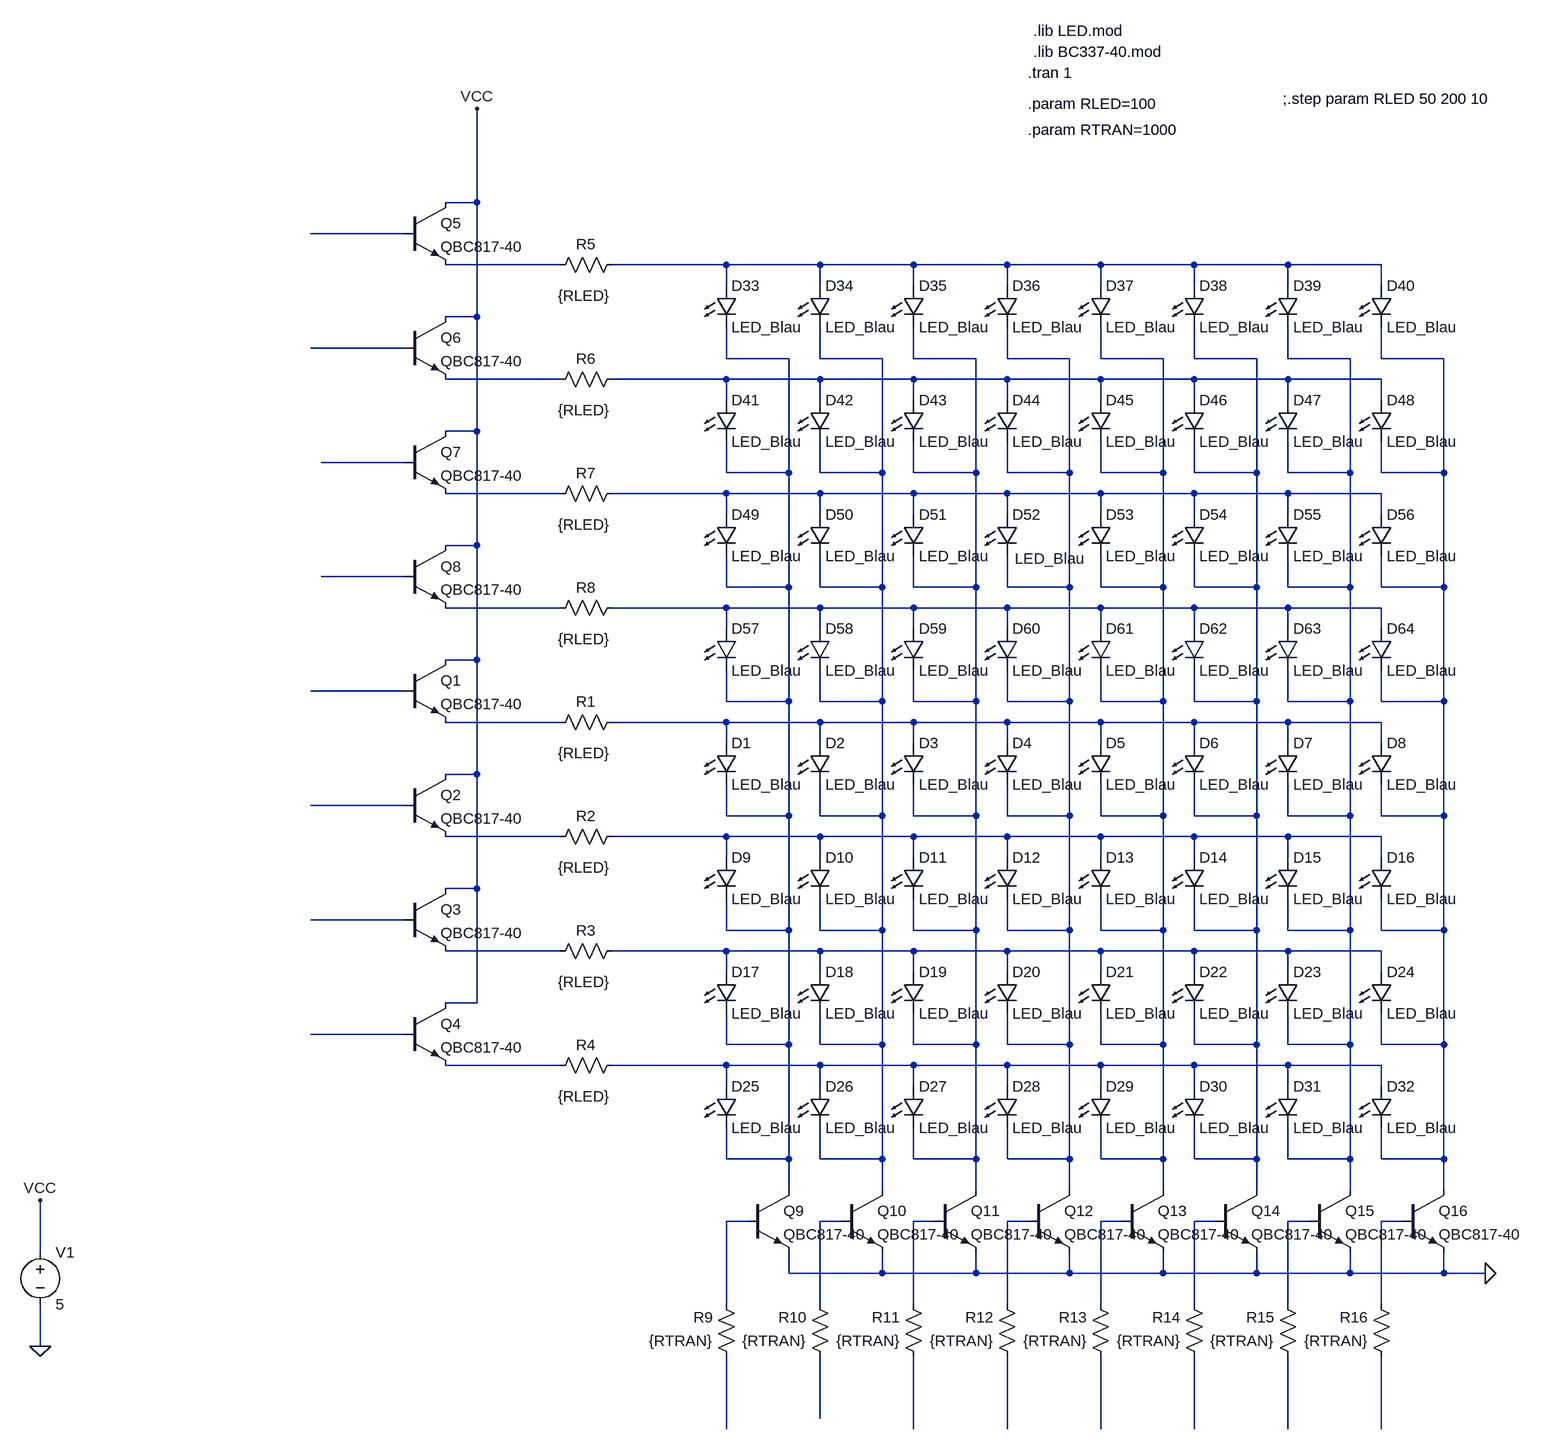
[diagram p0: schematic Schaltplan.asc]
Schaltplan.asc, the LTspice schematic file:
Version 4
SHEET 1 1296 808
WIRE -400 -1136 -400 -1280
WIRE -400 -1136 -448 -1136
WIRE -512 -1088 -656 -1088
WIRE -272 -1040 -448 -1040
WIRE -16 -1040 -192 -1040
WIRE 128 -1040 -16 -1040
WIRE 272 -1040 128 -1040
WIRE 416 -1040 272 -1040
WIRE 560 -1040 416 -1040
WIRE 704 -1040 560 -1040
WIRE 848 -1040 704 -1040
WIRE 992 -1040 848 -1040
WIRE -16 -1008 -16 -1040
WIRE 128 -1008 128 -1040
WIRE 272 -1008 272 -1040
WIRE 416 -1008 416 -1040
WIRE 560 -1008 560 -1040
WIRE 704 -1008 704 -1040
WIRE 848 -1008 848 -1040
WIRE 992 -1008 992 -1040
WIRE -400 -960 -400 -1136
WIRE -400 -960 -448 -960
WIRE -512 -912 -656 -912
WIRE -16 -896 -16 -944
WIRE 80 -896 -16 -896
WIRE 128 -896 128 -944
WIRE 224 -896 128 -896
WIRE 272 -896 272 -944
WIRE 368 -896 272 -896
WIRE 416 -896 416 -944
WIRE 512 -896 416 -896
WIRE 560 -896 560 -944
WIRE 656 -896 560 -896
WIRE 704 -896 704 -944
WIRE 800 -896 704 -896
WIRE 848 -896 848 -944
WIRE 944 -896 848 -896
WIRE 992 -896 992 -944
WIRE 1088 -896 992 -896
WIRE -272 -864 -448 -864
WIRE -16 -864 -192 -864
WIRE 128 -864 -16 -864
WIRE 272 -864 128 -864
WIRE 416 -864 272 -864
WIRE 560 -864 416 -864
WIRE 704 -864 560 -864
WIRE 848 -864 704 -864
WIRE 992 -864 848 -864
WIRE -16 -832 -16 -864
WIRE 128 -832 128 -864
WIRE 272 -832 272 -864
WIRE 416 -832 416 -864
WIRE 560 -832 560 -864
WIRE 704 -832 704 -864
WIRE 848 -832 848 -864
WIRE 992 -832 992 -864
WIRE -400 -784 -400 -960
WIRE -400 -784 -448 -784
WIRE -512 -736 -640 -736
WIRE -16 -720 -16 -768
WIRE 80 -720 80 -896
WIRE 80 -720 -16 -720
WIRE 128 -720 128 -768
WIRE 224 -720 224 -896
WIRE 224 -720 128 -720
WIRE 272 -720 272 -768
WIRE 368 -720 368 -896
WIRE 368 -720 272 -720
WIRE 416 -720 416 -768
WIRE 512 -720 512 -896
WIRE 512 -720 416 -720
WIRE 560 -720 560 -768
WIRE 656 -720 656 -896
WIRE 656 -720 560 -720
WIRE 704 -720 704 -768
WIRE 800 -720 800 -896
WIRE 800 -720 704 -720
WIRE 848 -720 848 -768
WIRE 944 -720 944 -896
WIRE 944 -720 848 -720
WIRE 992 -720 992 -768
WIRE 1088 -720 1088 -896
WIRE 1088 -720 992 -720
WIRE -272 -688 -448 -688
WIRE -16 -688 -192 -688
WIRE 128 -688 -16 -688
WIRE 272 -688 128 -688
WIRE 416 -688 272 -688
WIRE 560 -688 416 -688
WIRE 704 -688 560 -688
WIRE 848 -688 704 -688
WIRE 992 -688 848 -688
WIRE -16 -656 -16 -688
WIRE 128 -656 128 -688
WIRE 272 -656 272 -688
WIRE 416 -656 416 -688
WIRE 560 -656 560 -688
WIRE 704 -656 704 -688
WIRE 848 -656 848 -688
WIRE 992 -656 992 -688
WIRE -400 -608 -400 -784
WIRE -400 -608 -448 -608
WIRE -512 -560 -640 -560
WIRE -16 -544 -16 -592
WIRE 80 -544 80 -720
WIRE 80 -544 -16 -544
WIRE 128 -544 128 -592
WIRE 224 -544 224 -720
WIRE 224 -544 128 -544
WIRE 272 -544 272 -592
WIRE 368 -544 368 -720
WIRE 368 -544 272 -544
WIRE 416 -544 416 -592
WIRE 512 -544 512 -720
WIRE 512 -544 416 -544
WIRE 560 -544 560 -592
WIRE 656 -544 656 -720
WIRE 656 -544 560 -544
WIRE 704 -544 704 -592
WIRE 800 -544 800 -720
WIRE 800 -544 704 -544
WIRE 848 -544 848 -592
WIRE 944 -544 944 -720
WIRE 944 -544 848 -544
WIRE 992 -544 992 -592
WIRE 1088 -544 1088 -720
WIRE 1088 -544 992 -544
WIRE -272 -512 -448 -512
WIRE -16 -512 -192 -512
WIRE 128 -512 -16 -512
WIRE 272 -512 128 -512
WIRE 416 -512 272 -512
WIRE 560 -512 416 -512
WIRE 704 -512 560 -512
WIRE 848 -512 704 -512
WIRE 992 -512 848 -512
WIRE -16 -480 -16 -512
WIRE 128 -480 128 -512
WIRE 272 -480 272 -512
WIRE 416 -480 416 -512
WIRE 560 -480 560 -512
WIRE 704 -480 704 -512
WIRE 848 -480 848 -512
WIRE 992 -480 992 -512
WIRE -400 -432 -400 -608
WIRE -400 -432 -448 -432
WIRE -512 -384 -656 -384
WIRE -16 -368 -16 -416
WIRE 80 -368 80 -544
WIRE 80 -368 -16 -368
WIRE 128 -368 128 -416
WIRE 224 -368 224 -544
WIRE 224 -368 128 -368
WIRE 272 -368 272 -416
WIRE 368 -368 368 -544
WIRE 368 -368 272 -368
WIRE 416 -368 416 -416
WIRE 512 -368 512 -544
WIRE 512 -368 416 -368
WIRE 560 -368 560 -416
WIRE 656 -368 656 -544
WIRE 656 -368 560 -368
WIRE 704 -368 704 -416
WIRE 800 -368 800 -544
WIRE 800 -368 704 -368
WIRE 848 -368 848 -416
WIRE 944 -368 944 -544
WIRE 944 -368 848 -368
WIRE 992 -368 992 -416
WIRE 1088 -368 1088 -544
WIRE 1088 -368 992 -368
WIRE -272 -336 -448 -336
WIRE -16 -336 -192 -336
WIRE 128 -336 -16 -336
WIRE 272 -336 128 -336
WIRE 416 -336 272 -336
WIRE 560 -336 416 -336
WIRE 704 -336 560 -336
WIRE 848 -336 704 -336
WIRE 992 -336 848 -336
WIRE -16 -304 -16 -336
WIRE 128 -304 128 -336
WIRE 272 -304 272 -336
WIRE 416 -304 416 -336
WIRE 560 -304 560 -336
WIRE 704 -304 704 -336
WIRE 848 -304 848 -336
WIRE 992 -304 992 -336
WIRE -400 -256 -400 -432
WIRE -400 -256 -448 -256
WIRE -512 -208 -656 -208
WIRE -16 -192 -16 -240
WIRE 80 -192 80 -368
WIRE 80 -192 -16 -192
WIRE 128 -192 128 -240
WIRE 224 -192 224 -368
WIRE 224 -192 128 -192
WIRE 272 -192 272 -240
WIRE 368 -192 368 -368
WIRE 368 -192 272 -192
WIRE 416 -192 416 -240
WIRE 512 -192 512 -368
WIRE 512 -192 416 -192
WIRE 560 -192 560 -240
WIRE 656 -192 656 -368
WIRE 656 -192 560 -192
WIRE 704 -192 704 -240
WIRE 800 -192 800 -368
WIRE 800 -192 704 -192
WIRE 848 -192 848 -240
WIRE 944 -192 944 -368
WIRE 944 -192 848 -192
WIRE 992 -192 992 -240
WIRE 1088 -192 1088 -368
WIRE 1088 -192 992 -192
WIRE -272 -160 -448 -160
WIRE -16 -160 -192 -160
WIRE 128 -160 -16 -160
WIRE 272 -160 128 -160
WIRE 416 -160 272 -160
WIRE 560 -160 416 -160
WIRE 704 -160 560 -160
WIRE 848 -160 704 -160
WIRE 992 -160 848 -160
WIRE -16 -128 -16 -160
WIRE 128 -128 128 -160
WIRE 272 -128 272 -160
WIRE 416 -128 416 -160
WIRE 560 -128 560 -160
WIRE 704 -128 704 -160
WIRE 848 -128 848 -160
WIRE 992 -128 992 -160
WIRE -400 -80 -400 -256
WIRE -400 -80 -448 -80
WIRE -512 -32 -656 -32
WIRE -16 -16 -16 -64
WIRE 80 -16 80 -192
WIRE 80 -16 -16 -16
WIRE 128 -16 128 -64
WIRE 224 -16 224 -192
WIRE 224 -16 128 -16
WIRE 272 -16 272 -64
WIRE 368 -16 368 -192
WIRE 368 -16 272 -16
WIRE 416 -16 416 -64
WIRE 512 -16 512 -192
WIRE 512 -16 416 -16
WIRE 560 -16 560 -64
WIRE 656 -16 656 -192
WIRE 656 -16 560 -16
WIRE 704 -16 704 -64
WIRE 800 -16 800 -192
WIRE 800 -16 704 -16
WIRE 848 -16 848 -64
WIRE 944 -16 944 -192
WIRE 944 -16 848 -16
WIRE 992 -16 992 -64
WIRE 1088 -16 1088 -192
WIRE 1088 -16 992 -16
WIRE -272 16 -448 16
WIRE -16 16 -192 16
WIRE 128 16 -16 16
WIRE 272 16 128 16
WIRE 416 16 272 16
WIRE 560 16 416 16
WIRE 704 16 560 16
WIRE 848 16 704 16
WIRE 992 16 848 16
WIRE -16 48 -16 16
WIRE 128 48 128 16
WIRE 272 48 272 16
WIRE 416 48 416 16
WIRE 560 48 560 16
WIRE 704 48 704 16
WIRE 848 48 848 16
WIRE 992 48 992 16
WIRE -400 96 -400 -80
WIRE -400 96 -448 96
WIRE -512 144 -656 144
WIRE -16 160 -16 112
WIRE 80 160 80 -16
WIRE 80 160 -16 160
WIRE 128 160 128 112
WIRE 224 160 224 -16
WIRE 224 160 128 160
WIRE 272 160 272 112
WIRE 368 160 368 -16
WIRE 368 160 272 160
WIRE 416 160 416 112
WIRE 512 160 512 -16
WIRE 512 160 416 160
WIRE 560 160 560 112
WIRE 656 160 656 -16
WIRE 656 160 560 160
WIRE 704 160 704 112
WIRE 800 160 800 -16
WIRE 800 160 704 160
WIRE 848 160 848 112
WIRE 944 160 944 -16
WIRE 944 160 848 160
WIRE 992 160 992 112
WIRE 1088 160 1088 -16
WIRE 1088 160 992 160
WIRE -272 192 -448 192
WIRE -16 192 -192 192
WIRE 128 192 -16 192
WIRE 272 192 128 192
WIRE 416 192 272 192
WIRE 560 192 416 192
WIRE 704 192 560 192
WIRE 848 192 704 192
WIRE 992 192 848 192
WIRE -16 224 -16 192
WIRE 128 224 128 192
WIRE 272 224 272 192
WIRE 416 224 416 192
WIRE 560 224 560 192
WIRE 704 224 704 192
WIRE 848 224 848 192
WIRE 992 224 992 192
WIRE -16 336 -16 288
WIRE 80 336 80 160
WIRE 80 336 -16 336
WIRE 128 336 128 288
WIRE 224 336 224 160
WIRE 224 336 128 336
WIRE 272 336 272 288
WIRE 368 336 368 160
WIRE 368 336 272 336
WIRE 416 336 416 288
WIRE 512 336 512 160
WIRE 512 336 416 336
WIRE 560 336 560 288
WIRE 656 336 656 160
WIRE 656 336 560 336
WIRE 704 336 704 288
WIRE 800 336 800 160
WIRE 800 336 704 336
WIRE 848 336 848 288
WIRE 944 336 944 160
WIRE 944 336 848 336
WIRE 992 336 992 288
WIRE 1088 336 1088 160
WIRE 1088 336 992 336
WIRE 80 384 80 336
WIRE 224 384 224 336
WIRE 368 384 368 336
WIRE 512 384 512 336
WIRE 656 384 656 336
WIRE 800 384 800 336
WIRE 944 384 944 336
WIRE 1088 384 1088 336
WIRE 16 432 -16 432
WIRE 160 432 128 432
WIRE 304 432 272 432
WIRE 448 432 416 432
WIRE 592 432 560 432
WIRE 736 432 704 432
WIRE 880 432 848 432
WIRE 1024 432 992 432
WIRE -1072 480 -1072 400
WIRE 80 512 80 480
WIRE 224 512 224 480
WIRE 224 512 80 512
WIRE 368 512 368 480
WIRE 368 512 224 512
WIRE 512 512 512 480
WIRE 512 512 368 512
WIRE 656 512 656 480
WIRE 656 512 512 512
WIRE 800 512 800 480
WIRE 800 512 656 512
WIRE 944 512 944 480
WIRE 944 512 800 512
WIRE 1088 512 1088 480
WIRE 1088 512 944 512
WIRE 1152 512 1088 512
WIRE -16 560 -16 432
WIRE 128 560 128 432
WIRE 272 560 272 432
WIRE 416 560 416 432
WIRE 560 560 560 432
WIRE 704 560 704 432
WIRE 848 560 848 432
WIRE 992 560 992 432
WIRE -1072 624 -1072 560
WIRE 128 736 128 640
WIRE -16 752 -16 640
WIRE 272 752 272 640
WIRE 416 752 416 640
WIRE 560 752 560 640
WIRE 704 752 704 640
WIRE 848 752 848 640
WIRE 992 752 992 640
FLAG 1152 512 0
FLAG -400 -1280 VCC
FLAG -1072 624 0
FLAG -1072 400 VCC
SYMBOL LED -32 -304 R0
SYMATTR InstName D1
SYMATTR Value LED_Blau
SYMBOL res -176 -352 R90
WINDOW 0 0 56 VBottom 2
WINDOW 3 48 59 VTop 2
SYMATTR InstName R1
SYMATTR Value {RLED}
SYMBOL npn -512 -432 R0
SYMATTR InstName Q1
SYMATTR Value QBC817-40
SYMBOL LED 112 -304 R0
SYMATTR InstName D2
SYMATTR Value LED_Blau
SYMBOL LED 256 -304 R0
SYMATTR InstName D3
SYMATTR Value LED_Blau
SYMBOL LED 400 -304 R0
SYMATTR InstName D4
SYMATTR Value LED_Blau
SYMBOL LED 544 -304 R0
SYMATTR InstName D5
SYMATTR Value LED_Blau
SYMBOL LED 688 -304 R0
SYMATTR InstName D6
SYMATTR Value LED_Blau
SYMBOL LED 832 -304 R0
SYMATTR InstName D7
SYMATTR Value LED_Blau
SYMBOL LED 976 -304 R0
SYMATTR InstName D8
SYMATTR Value LED_Blau
SYMBOL LED -32 -128 R0
SYMATTR InstName D9
SYMATTR Value LED_Blau
SYMBOL res -176 -176 R90
WINDOW 0 0 56 VBottom 2
WINDOW 3 48 59 VTop 2
SYMATTR InstName R2
SYMATTR Value {RLED}
SYMBOL npn -512 -256 R0
SYMATTR InstName Q2
SYMATTR Value QBC817-40
SYMBOL LED 112 -128 R0
SYMATTR InstName D10
SYMATTR Value LED_Blau
SYMBOL LED 256 -128 R0
SYMATTR InstName D11
SYMATTR Value LED_Blau
SYMBOL LED 400 -128 R0
SYMATTR InstName D12
SYMATTR Value LED_Blau
SYMBOL LED 544 -128 R0
SYMATTR InstName D13
SYMATTR Value LED_Blau
SYMBOL LED 688 -128 R0
SYMATTR InstName D14
SYMATTR Value LED_Blau
SYMBOL LED 832 -128 R0
SYMATTR InstName D15
SYMATTR Value LED_Blau
SYMBOL LED 976 -128 R0
SYMATTR InstName D16
SYMATTR Value LED_Blau
SYMBOL LED -32 48 R0
SYMATTR InstName D17
SYMATTR Value LED_Blau
SYMBOL res -176 0 R90
WINDOW 0 0 56 VBottom 2
WINDOW 3 48 59 VTop 2
SYMATTR InstName R3
SYMATTR Value {RLED}
SYMBOL npn -512 -80 R0
SYMATTR InstName Q3
SYMATTR Value QBC817-40
SYMBOL LED 112 48 R0
SYMATTR InstName D18
SYMATTR Value LED_Blau
SYMBOL LED 256 48 R0
SYMATTR InstName D19
SYMATTR Value LED_Blau
SYMBOL LED 400 48 R0
SYMATTR InstName D20
SYMATTR Value LED_Blau
SYMBOL LED 544 48 R0
SYMATTR InstName D21
SYMATTR Value LED_Blau
SYMBOL LED 688 48 R0
SYMATTR InstName D22
SYMATTR Value LED_Blau
SYMBOL LED 832 48 R0
SYMATTR InstName D23
SYMATTR Value LED_Blau
SYMBOL LED 976 48 R0
SYMATTR InstName D24
SYMATTR Value LED_Blau
SYMBOL LED -32 224 R0
SYMATTR InstName D25
SYMATTR Value LED_Blau
SYMBOL res -176 176 R90
WINDOW 0 0 56 VBottom 2
WINDOW 3 48 59 VTop 2
SYMATTR InstName R4
SYMATTR Value {RLED}
SYMBOL npn -512 96 R0
SYMATTR InstName Q4
SYMATTR Value QBC817-40
SYMBOL LED 112 224 R0
SYMATTR InstName D26
SYMATTR Value LED_Blau
SYMBOL LED 256 224 R0
SYMATTR InstName D27
SYMATTR Value LED_Blau
SYMBOL LED 400 224 R0
SYMATTR InstName D28
SYMATTR Value LED_Blau
SYMBOL LED 544 224 R0
SYMATTR InstName D29
SYMATTR Value LED_Blau
SYMBOL LED 688 224 R0
SYMATTR InstName D30
SYMATTR Value LED_Blau
SYMBOL LED 832 224 R0
SYMATTR InstName D31
SYMATTR Value LED_Blau
SYMBOL LED 976 224 R0
SYMATTR InstName D32
SYMATTR Value LED_Blau
SYMBOL LED -32 -1008 R0
SYMATTR InstName D33
SYMATTR Value LED_Blau
SYMBOL res -176 -1056 R90
WINDOW 0 0 56 VBottom 2
WINDOW 3 48 59 VTop 2
SYMATTR InstName R5
SYMATTR Value {RLED}
SYMBOL npn -512 -1136 R0
SYMATTR InstName Q5
SYMATTR Value QBC817-40
SYMBOL LED 112 -1008 R0
SYMATTR InstName D34
SYMATTR Value LED_Blau
SYMBOL LED 256 -1008 R0
SYMATTR InstName D35
SYMATTR Value LED_Blau
SYMBOL LED 400 -1008 R0
SYMATTR InstName D36
SYMATTR Value LED_Blau
SYMBOL LED 544 -1008 R0
SYMATTR InstName D37
SYMATTR Value LED_Blau
SYMBOL LED 688 -1008 R0
SYMATTR InstName D38
SYMATTR Value LED_Blau
SYMBOL LED 832 -1008 R0
SYMATTR InstName D39
SYMATTR Value LED_Blau
SYMBOL LED 976 -1008 R0
SYMATTR InstName D40
SYMATTR Value LED_Blau
SYMBOL LED -32 -832 R0
SYMATTR InstName D41
SYMATTR Value LED_Blau
SYMBOL res -176 -880 R90
WINDOW 0 0 56 VBottom 2
WINDOW 3 48 59 VTop 2
SYMATTR InstName R6
SYMATTR Value {RLED}
SYMBOL npn -512 -960 R0
SYMATTR InstName Q6
SYMATTR Value QBC817-40
SYMBOL LED 112 -832 R0
SYMATTR InstName D42
SYMATTR Value LED_Blau
SYMBOL LED 256 -832 R0
SYMATTR InstName D43
SYMATTR Value LED_Blau
SYMBOL LED 400 -832 R0
SYMATTR InstName D44
SYMATTR Value LED_Blau
SYMBOL LED 544 -832 R0
SYMATTR InstName D45
SYMATTR Value LED_Blau
SYMBOL LED 688 -832 R0
SYMATTR InstName D46
SYMATTR Value LED_Blau
SYMBOL LED 832 -832 R0
SYMATTR InstName D47
SYMATTR Value LED_Blau
SYMBOL LED 976 -832 R0
SYMATTR InstName D48
SYMATTR Value LED_Blau
SYMBOL LED -32 -656 R0
SYMATTR InstName D49
SYMATTR Value LED_Blau
SYMBOL res -176 -704 R90
WINDOW 0 0 56 VBottom 2
WINDOW 3 48 59 VTop 2
SYMATTR InstName R7
SYMATTR Value {RLED}
SYMBOL npn -512 -784 R0
SYMATTR InstName Q7
SYMATTR Value QBC817-40
SYMBOL LED 112 -656 R0
SYMATTR InstName D50
SYMATTR Value LED_Blau
SYMBOL LED 256 -656 R0
SYMATTR InstName D51
SYMATTR Value LED_Blau
SYMBOL LED 400 -656 R0
WINDOW 3 28 68 Left 2
SYMATTR Value LED_Blau
SYMATTR InstName D52
SYMBOL LED 544 -656 R0
SYMATTR InstName D53
SYMATTR Value LED_Blau
SYMBOL LED 688 -656 R0
SYMATTR InstName D54
SYMATTR Value LED_Blau
SYMBOL LED 832 -656 R0
SYMATTR InstName D55
SYMATTR Value LED_Blau
SYMBOL LED 976 -656 R0
SYMATTR InstName D56
SYMATTR Value LED_Blau
SYMBOL LED -32 -480 R0
SYMATTR InstName D57
SYMATTR Value LED_Blau
SYMBOL res -176 -528 R90
WINDOW 0 0 56 VBottom 2
WINDOW 3 48 59 VTop 2
SYMATTR InstName R8
SYMATTR Value {RLED}
SYMBOL npn -512 -608 R0
SYMATTR InstName Q8
SYMATTR Value QBC817-40
SYMBOL LED 112 -480 R0
SYMATTR InstName D58
SYMATTR Value LED_Blau
SYMBOL LED 256 -480 R0
SYMATTR InstName D59
SYMATTR Value LED_Blau
SYMBOL LED 400 -480 R0
SYMATTR InstName D60
SYMATTR Value LED_Blau
SYMBOL LED 544 -480 R0
SYMATTR InstName D61
SYMATTR Value LED_Blau
SYMBOL LED 688 -480 R0
SYMATTR InstName D62
SYMATTR Value LED_Blau
SYMBOL LED 832 -480 R0
SYMATTR InstName D63
SYMATTR Value LED_Blau
SYMBOL LED 976 -480 R0
SYMATTR InstName D64
SYMATTR Value LED_Blau
SYMBOL npn 16 384 R0
SYMATTR InstName Q9
SYMATTR Value QBC817-40
SYMBOL npn 160 384 R0
SYMATTR InstName Q10
SYMATTR Value QBC817-40
SYMBOL npn 304 384 R0
SYMATTR InstName Q11
SYMATTR Value QBC817-40
SYMBOL npn 448 384 R0
SYMATTR InstName Q12
SYMATTR Value QBC817-40
SYMBOL npn 592 384 R0
SYMATTR InstName Q13
SYMATTR Value QBC817-40
SYMBOL npn 736 384 R0
SYMATTR InstName Q14
SYMATTR Value QBC817-40
SYMBOL npn 880 384 R0
SYMATTR InstName Q15
SYMATTR Value QBC817-40
SYMBOL npn 1024 384 R0
SYMATTR InstName Q16
SYMATTR Value QBC817-40
SYMBOL res 0 656 R180
WINDOW 0 36 76 Left 2
WINDOW 3 36 40 Left 2
SYMATTR InstName R9
SYMATTR Value {RTRAN}
SYMBOL res 144 656 R180
WINDOW 0 36 76 Left 2
WINDOW 3 36 40 Left 2
SYMATTR InstName R10
SYMATTR Value {RTRAN}
SYMBOL res 288 656 R180
WINDOW 0 36 76 Left 2
WINDOW 3 36 40 Left 2
SYMATTR InstName R11
SYMATTR Value {RTRAN}
SYMBOL res 432 656 R180
WINDOW 0 36 76 Left 2
WINDOW 3 36 40 Left 2
SYMATTR InstName R12
SYMATTR Value {RTRAN}
SYMBOL res 576 656 R180
WINDOW 0 36 76 Left 2
WINDOW 3 36 40 Left 2
SYMATTR InstName R13
SYMATTR Value {RTRAN}
SYMBOL res 720 656 R180
WINDOW 0 36 76 Left 2
WINDOW 3 36 40 Left 2
SYMATTR InstName R14
SYMATTR Value {RTRAN}
SYMBOL res 864 656 R180
WINDOW 0 36 76 Left 2
WINDOW 3 36 40 Left 2
SYMATTR InstName R15
SYMATTR Value {RTRAN}
SYMBOL res 1008 656 R180
WINDOW 0 36 76 Left 2
WINDOW 3 36 40 Left 2
SYMATTR InstName R16
SYMATTR Value {RTRAN}
SYMBOL voltage -1072 464 R0
WINDOW 123 0 0 Left 2
WINDOW 39 0 0 Left 2
SYMATTR InstName V1
SYMATTR Value 5
TEXT 456 -1368 Left 2 !.lib BC337-40.mod
TEXT 456 -1400 Left 2 !.lib LED.mod
TEXT 448 -1336 Left 2 !.tran 1
TEXT 448 -1288 Left 2 !.param RLED=100
TEXT 448 -1248 Left 2 !.param RTRAN=1000
TEXT 840 -1296 Left 2 !;.step param RLED 50 200 10

The netlist it stands for:
* Schaltplan.asc
D1 N023 N005 LED_Blau
R1 N023 N022 {RLED}
Q1 VCC N021 N022 0 QBC817-40
D2 N023 N006 LED_Blau
D3 N023 N007 LED_Blau
D4 N023 N008 LED_Blau
D5 N023 N009 LED_Blau
D6 N023 N010 LED_Blau
D7 N023 N011 LED_Blau
D8 N023 N012 LED_Blau
D9 N026 N005 LED_Blau
R2 N026 N025 {RLED}
Q2 VCC N024 N025 0 QBC817-40
D10 N026 N006 LED_Blau
D11 N026 N007 LED_Blau
D12 N026 N008 LED_Blau
D13 N026 N009 LED_Blau
D14 N026 N010 LED_Blau
D15 N026 N011 LED_Blau
D16 N026 N012 LED_Blau
D17 N029 N005 LED_Blau
R3 N029 N028 {RLED}
Q3 VCC N027 N028 0 QBC817-40
D18 N029 N006 LED_Blau
D19 N029 N007 LED_Blau
D20 N029 N008 LED_Blau
D21 N029 N009 LED_Blau
D22 N029 N010 LED_Blau
D23 N029 N011 LED_Blau
D24 N029 N012 LED_Blau
D25 N032 N005 LED_Blau
R4 N032 N031 {RLED}
Q4 VCC N030 N031 0 QBC817-40
D26 N032 N006 LED_Blau
D27 N032 N007 LED_Blau
D28 N032 N008 LED_Blau
D29 N032 N009 LED_Blau
D30 N032 N010 LED_Blau
D31 N032 N011 LED_Blau
D32 N032 N012 LED_Blau
D33 N003 N005 LED_Blau
R5 N003 N002 {RLED}
Q5 VCC N001 N002 0 QBC817-40
D34 N003 N006 LED_Blau
D35 N003 N007 LED_Blau
D36 N003 N008 LED_Blau
D37 N003 N009 LED_Blau
D38 N003 N010 LED_Blau
D39 N003 N011 LED_Blau
D40 N003 N012 LED_Blau
D41 N014 N005 LED_Blau
R6 N014 N013 {RLED}
Q6 VCC N004 N013 0 QBC817-40
D42 N014 N006 LED_Blau
D43 N014 N007 LED_Blau
D44 N014 N008 LED_Blau
D45 N014 N009 LED_Blau
D46 N014 N010 LED_Blau
D47 N014 N011 LED_Blau
D48 N014 N012 LED_Blau
D49 N017 N005 LED_Blau
R7 N017 N016 {RLED}
Q7 VCC N015 N016 0 QBC817-40
D50 N017 N006 LED_Blau
D51 N017 N007 LED_Blau
D52 N017 N008 LED_Blau
D53 N017 N009 LED_Blau
D54 N017 N010 LED_Blau
D55 N017 N011 LED_Blau
D56 N017 N012 LED_Blau
D57 N020 N005 LED_Blau
R8 N020 N019 {RLED}
Q8 VCC N018 N019 0 QBC817-40
D58 N020 N006 LED_Blau
D59 N020 N007 LED_Blau
D60 N020 N008 LED_Blau
D61 N020 N009 LED_Blau
D62 N020 N010 LED_Blau
D63 N020 N011 LED_Blau
D64 N020 N012 LED_Blau
Q9 N005 N033 0 0 QBC817-40
Q10 N006 N034 0 0 QBC817-40
Q11 N007 N035 0 0 QBC817-40
Q12 N008 N036 0 0 QBC817-40
Q13 N009 N037 0 0 QBC817-40
Q14 N010 N038 0 0 QBC817-40
Q15 N011 N039 0 0 QBC817-40
Q16 N012 N040 0 0 QBC817-40
R9 N042 N033 {RTRAN}
R10 N041 N034 {RTRAN}
R11 N043 N035 {RTRAN}
R12 N044 N036 {RTRAN}
R13 N045 N037 {RTRAN}
R14 N046 N038 {RTRAN}
R15 N047 N039 {RTRAN}
R16 N048 N040 {RTRAN}
V1 VCC 0 5
.model D D
.lib standard.dio
.model NPN NPN
.model PNP PNP
.lib standard.bjt
.lib BC337-40.mod
.lib LED.mod
.tran 1
.param RLED=100
.param RTRAN=1000
;.step param RLED 50 200 10
.backanno
.end